# Altium project 004-H-01 SD data logger.PrjPcb
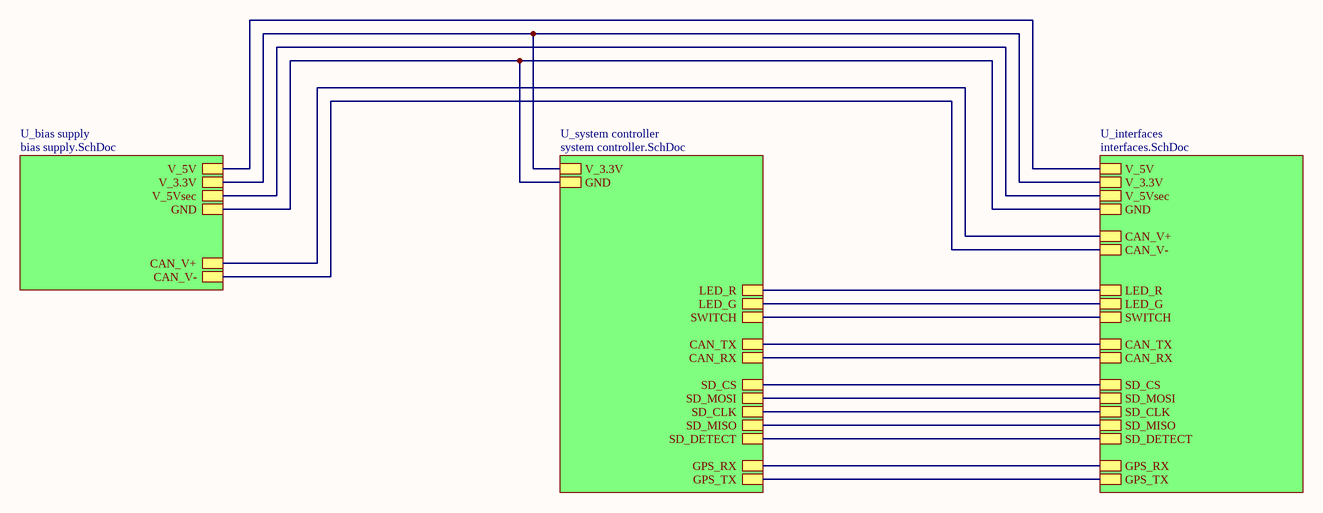
[diagram p0: 004-H-01 SD data logger cover.SchDoc]
4 sheets, 97 parts. Net scope: hierarchical (ports join the sheet entries above them; power ports are global).
Board file: 004-H-01 SD data logger.PcbDoc
Sheets:
  004-H-01 SD data logger cover.SchDoc
    U_bias supply = bias supply.SchDoc
    U_interfaces = interfaces.SchDoc
    U_system controller = system controller.SchDoc

## Sheet 004-H-01 SD data logger cover.SchDoc: 004-H-01 SD data logger
size A3; Organization: Sunflare Solar Team; Address1: Drachten; Address2: The Netherlands; Revision: V1.00; SheetNumber: 1; SheetTotal: 1

### Sub-sheets
U_bias supply = bias supply.SchDoc: V_5V, V_5Vsec, V_3.3V, GND, CAN_V-, CAN_V+
U_interfaces = interfaces.SchDoc: CAN_V-, CAN_V+, CAN_TX, CAN_RX, LED_R, LED_G, V_5V, V_3.3V, V_5Vsec, GND, SWITCH, SD_CS, SD_MOSI, SD_CLK, SD_MISO, SD_DETECT, GPS_RX, GPS_TX
U_system controller = system controller.SchDoc: V_3.3V, GND, CAN_TX, CAN_RX, LED_R, LED_G, SWITCH, SD_CS, SD_MOSI, SD_CLK, SD_MISO, SD_DETECT, GPS_RX, GPS_TX

### Nets
3.3V: sheet U_bias supply/V_3.3V, sheet U_interfaces/V_3.3V, sheet U_system controller/V_3.3V
5V: sheet U_bias supply/V_5V, sheet U_interfaces/V_5V
5Vsec: sheet U_bias supply/V_5Vsec, sheet U_interfaces/V_5Vsec
GND: sheet U_bias supply/GND, sheet U_interfaces/GND, sheet U_system controller/GND
CAN_+: sheet U_bias supply/CAN_V+, sheet U_interfaces/CAN_V+
CAN_-: sheet U_bias supply/CAN_V-, sheet U_interfaces/CAN_V-
CAN_RX: sheet U_interfaces/CAN_RX, sheet U_system controller/CAN_RX
CAN_TX: sheet U_interfaces/CAN_TX, sheet U_system controller/CAN_TX
LED_G: sheet U_interfaces/LED_R, sheet U_system controller/LED_R
LED_R: sheet U_interfaces/LED_G, sheet U_system controller/LED_G
NetR204_1: sheet U_interfaces/SD_CS, sheet U_system controller/SD_CS
NetR208_1: sheet U_interfaces/SWITCH, sheet U_system controller/SWITCH
NetR209_1: sheet U_interfaces/SD_MOSI, sheet U_system controller/SD_MOSI
NetR210_1: sheet U_interfaces/SD_CLK, sheet U_system controller/SD_CLK
NetR211_1: sheet U_interfaces/SD_MISO, sheet U_system controller/SD_MISO
NetR212_1: sheet U_interfaces/GPS_RX, sheet U_system controller/GPS_RX
NetR214_1: sheet U_interfaces/GPS_TX, sheet U_system controller/GPS_TX
NetR215_1: sheet U_interfaces/SD_DETECT, sheet U_system controller/SD_DETECT

### Notes on the sheet
- Title
- Size:
- Date:
- A3
- Version:
- Sheet
- of

## Sheet bias supply.SchDoc: 004-H-01 SD data logger
size A3; Organization: Sunflare Solar Team; Address1: Drachten; Address2: The Netherlands; Revision: V1.00; SheetNumber: 1; SheetTotal: 1
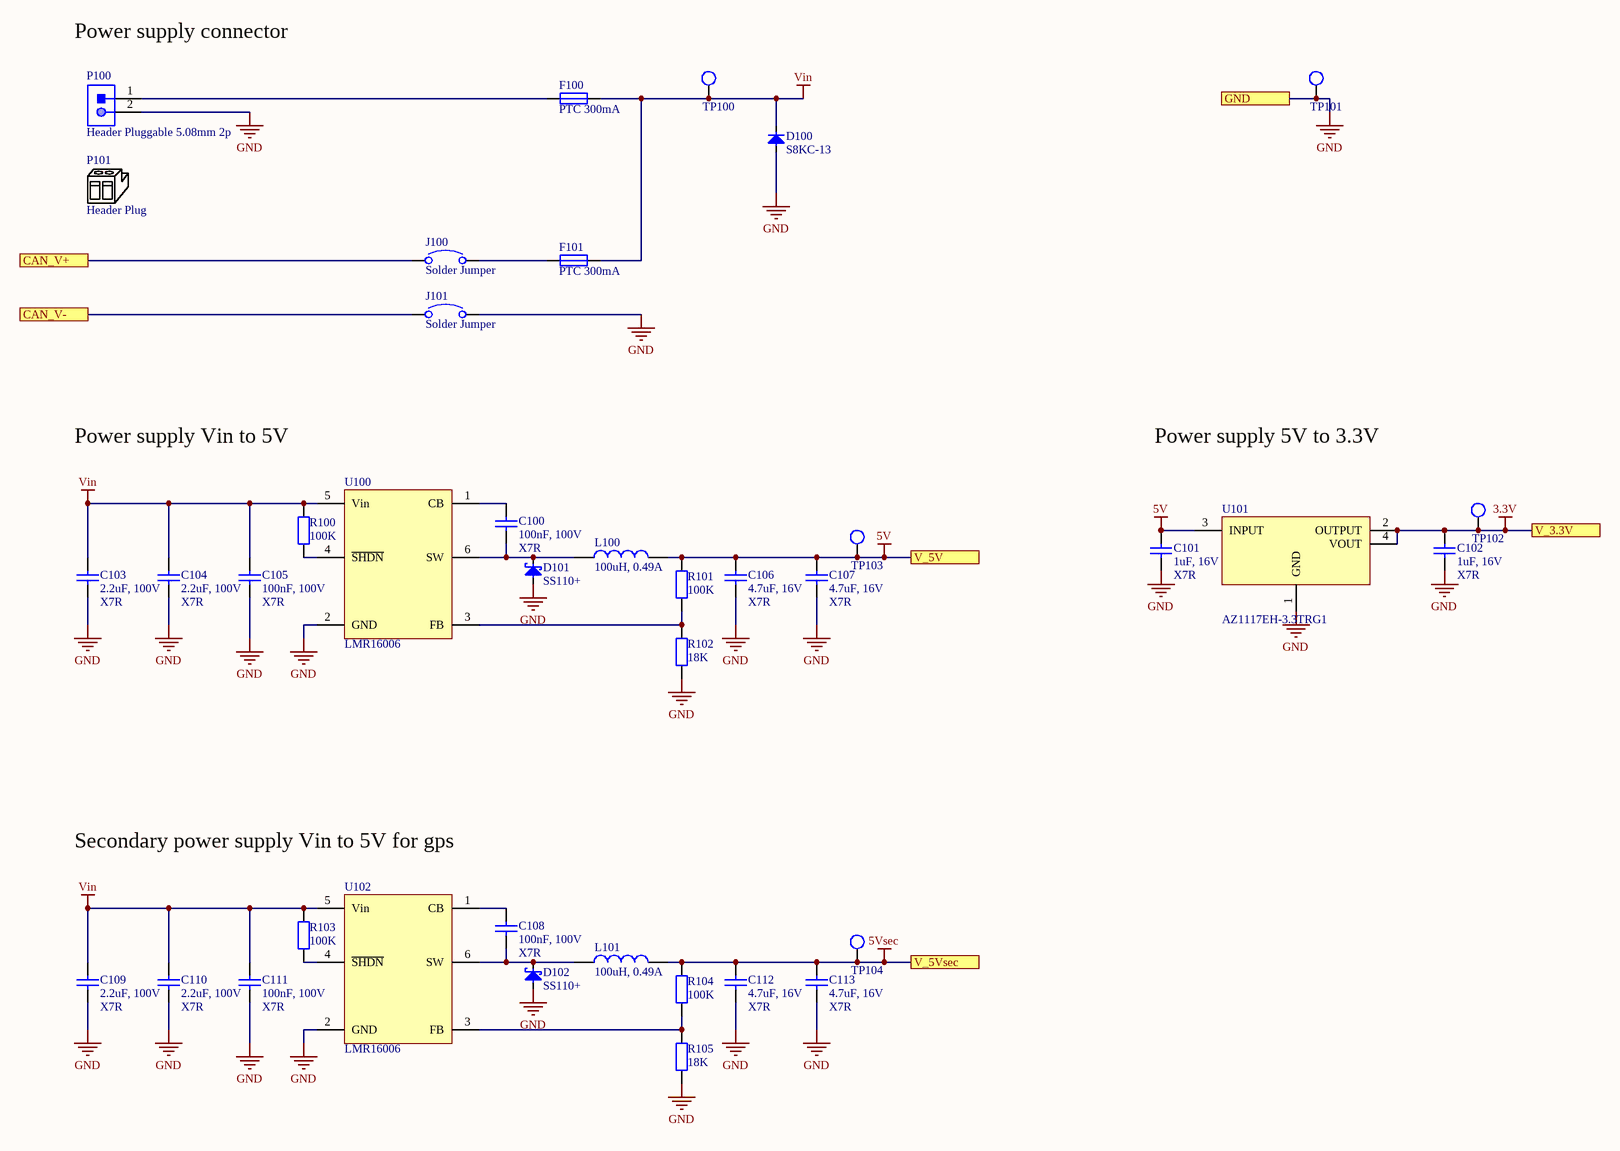
[diagram p1: bias supply.SchDoc]

### Parts
C100  100nF, 100V  Ceramic Type: X7R  [CAP_0805]
C101  1uF, 16V  Ceramic Type: X7R  [CAP_0805]
C102  1uF, 16V  Ceramic Type: X7R  [CAP_0805]
C103  2.2uF, 100V  Ceramic Type: X7R  [CAP_1210]
C104  2.2uF, 100V  Ceramic Type: X7R  [CAP_1210]
C105  100nF, 100V  Ceramic Type: X7R  [CAP_0805]
C106  4.7uF, 16V  Ceramic Type: X7R  [CAP_0805]
C107  4.7uF, 16V  Ceramic Type: X7R  [CAP_0805]
C108  100nF, 100V  Ceramic Type: X7R  [CAP_0805]
C109  2.2uF, 100V  Ceramic Type: X7R  [CAP_1210]
C110  2.2uF, 100V  Ceramic Type: X7R  [CAP_1210]
C111  100nF, 100V  Ceramic Type: X7R  [CAP_0805]
C112  4.7uF, 16V  Ceramic Type: X7R  [CAP_0805]
C113  4.7uF, 16V  Ceramic Type: X7R  [CAP_0805]
D100  S8KC-13  [DIODEDO-214AB]
D101  SS110+  [DIODEDO-214AC]
D102  SS110+  [DIODEDO-214AC]
F100  PTC 300mA  [PTC7451X12N]
F101  PTC 300mA  [PTC7451X12N]
J100  Solder Jumper  [SolderJumer]  (no BOM)
J101  Solder Jumper  [SolderJumer]  (no BOM)
L100  100uH, 0.49A  [WE-LQS_4025]
L101  100uH, 0.49A  [WE-LQS_4025]
P100  Header Pluggable 5.08mm 2p  [WE-691313510002]
P101  Header Plug  (mechanical)
R100  100K  [RES_0805]
R101  100K  [RES_0805]
R102  18K  [RES_0805]
R103  100K  [RES_0805]
R104  100K  [RES_0805]
R105  18K  [RES_0805]
TP100  Test Pad  [TestPad]  (value not drawn)  (no BOM)
TP101  Test Pad  [TestPad]  (value not drawn)  (no BOM)
TP102  Test Pad  [TestPad]  (value not drawn)  (no BOM)
TP103  Test Pad  [TestPad]  (value not drawn)  (no BOM)
TP104  Test Pad  [TestPad]  (value not drawn)  (no BOM)
U100  LMR16006  [SOT95P280X110-6N]
U101  AZ1117EH-3.3TRG1  [FP-SOT223-IPC_A]
U102  LMR16006  [SOT95P280X110-6N]

### Ports
CAN_V+, CAN_V-, GND, V_3.3V, V_5V, V_5Vsec

### Nets
3.3V: C102.1 TP102.1 U101.2(OUTPUT) U101.4(VOUT) ; port V_3.3V
5V: C101.2 C106.2 C107.1 L100.2 R101.2 TP103.1 U101.3(INPUT) ; port V_5V
5Vsec: C112.2 C113.1 L101.2 R104.2 TP104.1 ; port V_5Vsec
GND: C101.1 C102.2 C103.1 C104.2 C105.1 C106.1 C107.2 C109.1 C110.2 C111.1 C112.1 C113.2 D100.2(A) D101.2(A) D102.2(A) J101.2 P100.2 R102.1 R105.1 TP101.1 U100.2(GND) U101.1(GND) U102.2(GND) ; port GND
Vin: C103.2 C104.1 C105.2 C109.2 C110.1 C111.2 D100.1(K) F100.2 F101.2 R100.2 R103.2 TP100.1 U100.5(Vin) U102.5(Vin)
CAN_+: J100.1 ; port CAN_V+
CAN_-: J101.1 ; port CAN_V-
NetC100_1: C100.1 U100.1(CB)
NetC100_2: C100.2 D101.1(K) L100.1 U100.6(SW)
NetC108_1: C108.1 U102.1(CB)
NetC108_2: C108.2 D102.1(K) L101.1 U102.6(SW)
NetF100_1: F100.1 P100.1
NetF101_1: F101.1 J100.2
NetR100_1: R100.1 U100.4(~{SHDN})
NetR101_1: R101.1 R102.2 U100.3(FB)
NetR103_1: R103.1 U102.4(~{SHDN})
NetR104_1: R104.1 R105.2 U102.3(FB)

### Notes on the sheet
- Power supply connector
- Power supply Vin to 5V
- Power supply 5V to 3.3V
- Secondary power supply Vin to 5V for gps
- Title
- Size:
- Date:
- A3
- Version:
- Sheet
- of

### Library data of the parts
C100 C105 C108 C111 = CAP_0805_100nF_100V: WCAP-CSGP Multilayer Ceramic Chip Capacitor, General Purpose, size 0805, X7R, 100nF, 100V; Manufacturer Part Number: 885012207128; Manufacturer: Wurth Elektronik; Rated Voltage: 100VDC; Isolation Resistance: >=1GOhm; Capacitance Tolerance: +/-10%; Technical Reference: X7R0805104K100DFCT10000; ComponentLink1Description: Manufacturer; ComponentLink1URL: http://www.we-online.de; ComponentLink2Description: Datasheet; ComponentLink2URL: https://www.we-online.com/catalog/datasheet/885012207128.pdf; Operating Temperature: -55 to +125degC; Packaging: Tape and Reel; Published Date: May 2020; Dissipation Factor: =<2.5%; Height: 1.25mm; Mounting Technology: SMT; Size: 0805; Capacitance: 100nF; Supplier 1: Farnell; Supplier Part Number 1: 2812440
C101 C102 = CAP_0805_1uF_16V: WCAP-CSGP Multilayer Ceramic Chip Capacitor, General Purpose, size 0805, X7R, 1uF, 16V; Manufacturer Part Number: 885012207051; Manufacturer: Wurth Elektronik; Rated Voltage: 16VDC; Isolation Resistance: >=0.5GOhm; Capacitance Tolerance: +/-10%; Technical Reference: X7R0805105K016DFCT10000; ComponentLink1Description: Manufacturer; ComponentLink1URL: http://www.we-online.de; ComponentLink2Description: Datasheet; ComponentLink2URL: https://www.we-online.com/catalog/datasheet/885012207051.pdf; Operating Temperature: -55 to +125degC; Packaging: Tape and Reel; Published Date: May 2020; Dissipation Factor: =<5%; Height: 1.25mm; Mounting Technology: SMT; Size: 0805; Capacitance: 1uF; Supplier 1: Farnell; Supplier Part Number 1: 2534058
C103 C104 C109 C110 = CAP_1210_2.2uF_100V: WCAP-CSGP Multilayer Ceramic Chip Capacitor, General Purpose, size 1210, X7R, 2.2uF, 100V; Manufacturer Part Number: 885012209071; Manufacturer: Wurth Elektronik; Rated Voltage: 100VDC; Isolation Resistance: >=0.05GOhm; Capacitance Tolerance: +/-10%; Technical Reference: X7R1210225K100DFCT10000; ComponentLink1Description: Manufacturer; ComponentLink1URL: http://www.we-online.de; ComponentLink2Description: Datasheet; ComponentLink2URL: https://www.we-online.com/catalog/datasheet/885012209071.pdf; Operating Temperature: -55 to +125degC; Packaging: Tape and Reel; Published Date: May 2020; Dissipation Factor: =<5%; Height: 2.5mm; Mounting Technology: SMT; Size: 1210; Capacitance: 2.2uF
C106 C107 C112 C113 = CAP_0805_4.7uF_16V: WCAP-CSGP Multilayer Ceramic Chip Capacitor, General Purpose, size 0805, X7R, 4.7uF, 16V; Manufacturer Part Number: 885012207053; Manufacturer: Wurth Elektronik; Rated Voltage: 16VDC; Isolation Resistance: >=0.02GOhm; Capacitance Tolerance: +/-10%; Technical Reference: X7R0805475K016DFCT10000; ComponentLink1Description: Manufacturer; ComponentLink1URL: http://www.we-online.de; ComponentLink2Description: Datasheet; ComponentLink2URL: https://www.we-online.com/catalog/datasheet/885012207053.pdf; Operating Temperature: -55 to +125degC; Packaging: Tape and Reel; Published Date: May 2020; Dissipation Factor: =<10%; Height: 1.25mm; Mounting Technology: SMT; Size: 0805; Capacitance: 4.7uF; Supplier 1: Farnell; Supplier Part Number 1: 2495191
D100 = Diode S8KC-13: Diode; Manufacturer: Diodes inc; Manufacturer Part No: S8KC-13; Supplier 1: Farnell; Supplier Part Number 1: 3127431; Supplier 2: Farnell; Supplier Part Number 2: 2675073
D101 D102 = Diode Schottky SS110+: Diode Schottky; Manufacturer: Multicomp; Manufacturer Part No: SS110+; Supplier 1: Farnell; Supplier Part Number 1: 4085140
F100 F101 = PTC 300mA: Fuse; Manufacturer: Multicomp Pro; Manufacturer Part No: MC33189; Supplier 1: Farnell; Supplier Part Number 1: 1800748
J100 J101 = SolderJumper: Solder jumper open; Manufacturer: -; Manufacturer Part No: -
L100 L101 = Inductor 100uH 0.49A 1043mOhm: WE-LQS SMT Power Inductor, size 4025, 100uH, 0.49A; Manufacturer: Wurth Elektronik; Manufacturer Part Number: 74404043101A; Saturation Current: 0.29A; Self Resonant Frequency: 11MHz; ComponentLink1Description: Manufacturer; ComponentLink1URL: http://www.we-online.de; ComponentLink2Description: Datasheet; ComponentLink2URL: https://www.we-online.com/catalog/datasheet/74404043101A.pdf; Published Date: May 2020; Rated Current: 0.49A; DC Resistance: 1043mOhm; Operating Temperature: -40 to +125degC; Mounting Technology: SMT; Packaging: Tape and Reel; Inductance: 100uH; Size: 4025; Supplier 1: Farnell; Supplier Part Number 1: 2749073
P100 = Header Pluggable 5.08mm 2p: WR-TBL Serie 313 Close Horizontal PCB Header, Pluggable, pitch 5.08mm, 2p; Part Number: 691313510002; Compliance: RoHS; Modularity: No; Pin Number: 2; Rated Current [UL]: 20A; Working Voltage [UL]: 300VAC; ComponentLink1Description: Manufacturer; ComponentLink1URL: http://www.we-online.de; ComponentLink2URL: https://katalog.we-online.de/em/datasheet/691313510002.pdf; ComponentLink2Description: Datasheet; Mounting Technology: THT; Packaging: Box; Operating Temperature: -40 to +105degC; PCB/Cable/Panel: PCB; Pitch: 5.08mm; Published Date: October 2019; Type: Horizontal; Publisher: Wurth Elektronik; Application: Pluggable; Supplier 1: Farnell; Supplier Part Number 1: 1641993
P101 = Plug Pluggable 5.08mm 2p: WR-TBL Series 351 - 5.08 mm Vertical, pitch 5.08mm, 2p; Part Number: 691351500002; Compliance: RoHS; Modularity: No; PCB/Cable/Panel: Cable; Pin Number: 2; Rated Current [UL]: 20A; Working Voltage [UL]: 300VAC; ComponentLink1Description: Manufacturer; ComponentLink1URL: http://www.we-online.de; ComponentLink2URL: https://katalog.we-online.de/em/datasheet/691313510002.pdf; ComponentLink2Description: Datasheet; Packaging: Box; Operating Temperature: -40 to +105degC; Pitch: 5.08mm; Published Date: October 2019; Type: Plug; Publisher: Wurth Elektronik; Application: Pluggable; Supplier 1: Farnell; Supplier Part Number 1: 1641952
R100 R101 R103 R104 = RES_0805_100K: Thick Film Resistor, size 0805, 1%; Rated Power: 0.125W; Resistance Tolerance: +/-1%; Resistance: 100K; Height: 0.6mm; Operating Temperature: -55 to +155degC; Mounting Technology: SMT; Packaging: Tape and Reel; Size: 0805; Length: 2mm; Width: 1.25mm
R102 R105 = RES_0805_18K: Thick Film Resistor, size 0805, 1%; Rated Power: 0.125W; Resistance Tolerance: +/-1%; Resistance: 18K; Height: 0.6mm; Operating Temperature: -55 to +155degC; Mounting Technology: SMT; Packaging: Tape and Reel; Size: 0805; Length: 2mm; Width: 1.25mm
TP100-TP104 = Test Pad: Test pad 2mm; Manufacturer: -; Manufacturer Part No: -
U100 U102 = LMR16006: DC-DC Switching Buck (Step Down) Regulator, Adjustable, 4V-60Vin, 800mV-55Vout, 600mAout, TSOT-23-6; Manufacturer: Texas Instruments; Manufacturer Part No: LMR16006XDDCT; Supplier 1: Farnell; Supplier Part Number 1: 3121632
U101 = AZ1117EH-3.3TRG1: IC REG LINEAR 3.3V 1A SOT223; Manufacturer: Diodes Inc; Operating Supply Current: 3.5mA; Polarity: Positive; Reference Voltage: 1.262V; Max Input Voltage: 13V; Accuracy: 1%; Power Supply Rejection Ratio (PSRR): 70dB; Number of Regulators: 1; Dropout Voltage: 1.1V; Output Type: Fixed; Output Voltage: 3.3V; Package Quantity: 4000; Lead Free: Lead Free; Number of Pins: 3; Output Current: 1A; Packaging: Tape and Reel; Min Operating Temperature: -40°C; Max Operating Temperature: 125°C; Quiescent Current: 3.5mA; Contact Plating: Tin; Case/Package: TO-261-4; Weight: 0.000282oz; Mount: Surface Mount; Number of Outputs: 1; Max Output Current: 1A; Manufacturer Part Number: AZ1117EH-3.3TRG1; Supplier 1: Farnell; Supplier Part Number 1: 3483084

## Sheet interfaces.SchDoc: 004-H-01 SD data logger
size A3; Organization: Sunflare Solar Team; Address1: Drachten; Address2: The Netherlands; Revision: V1.00; SheetNumber: 1; SheetTotal: 1
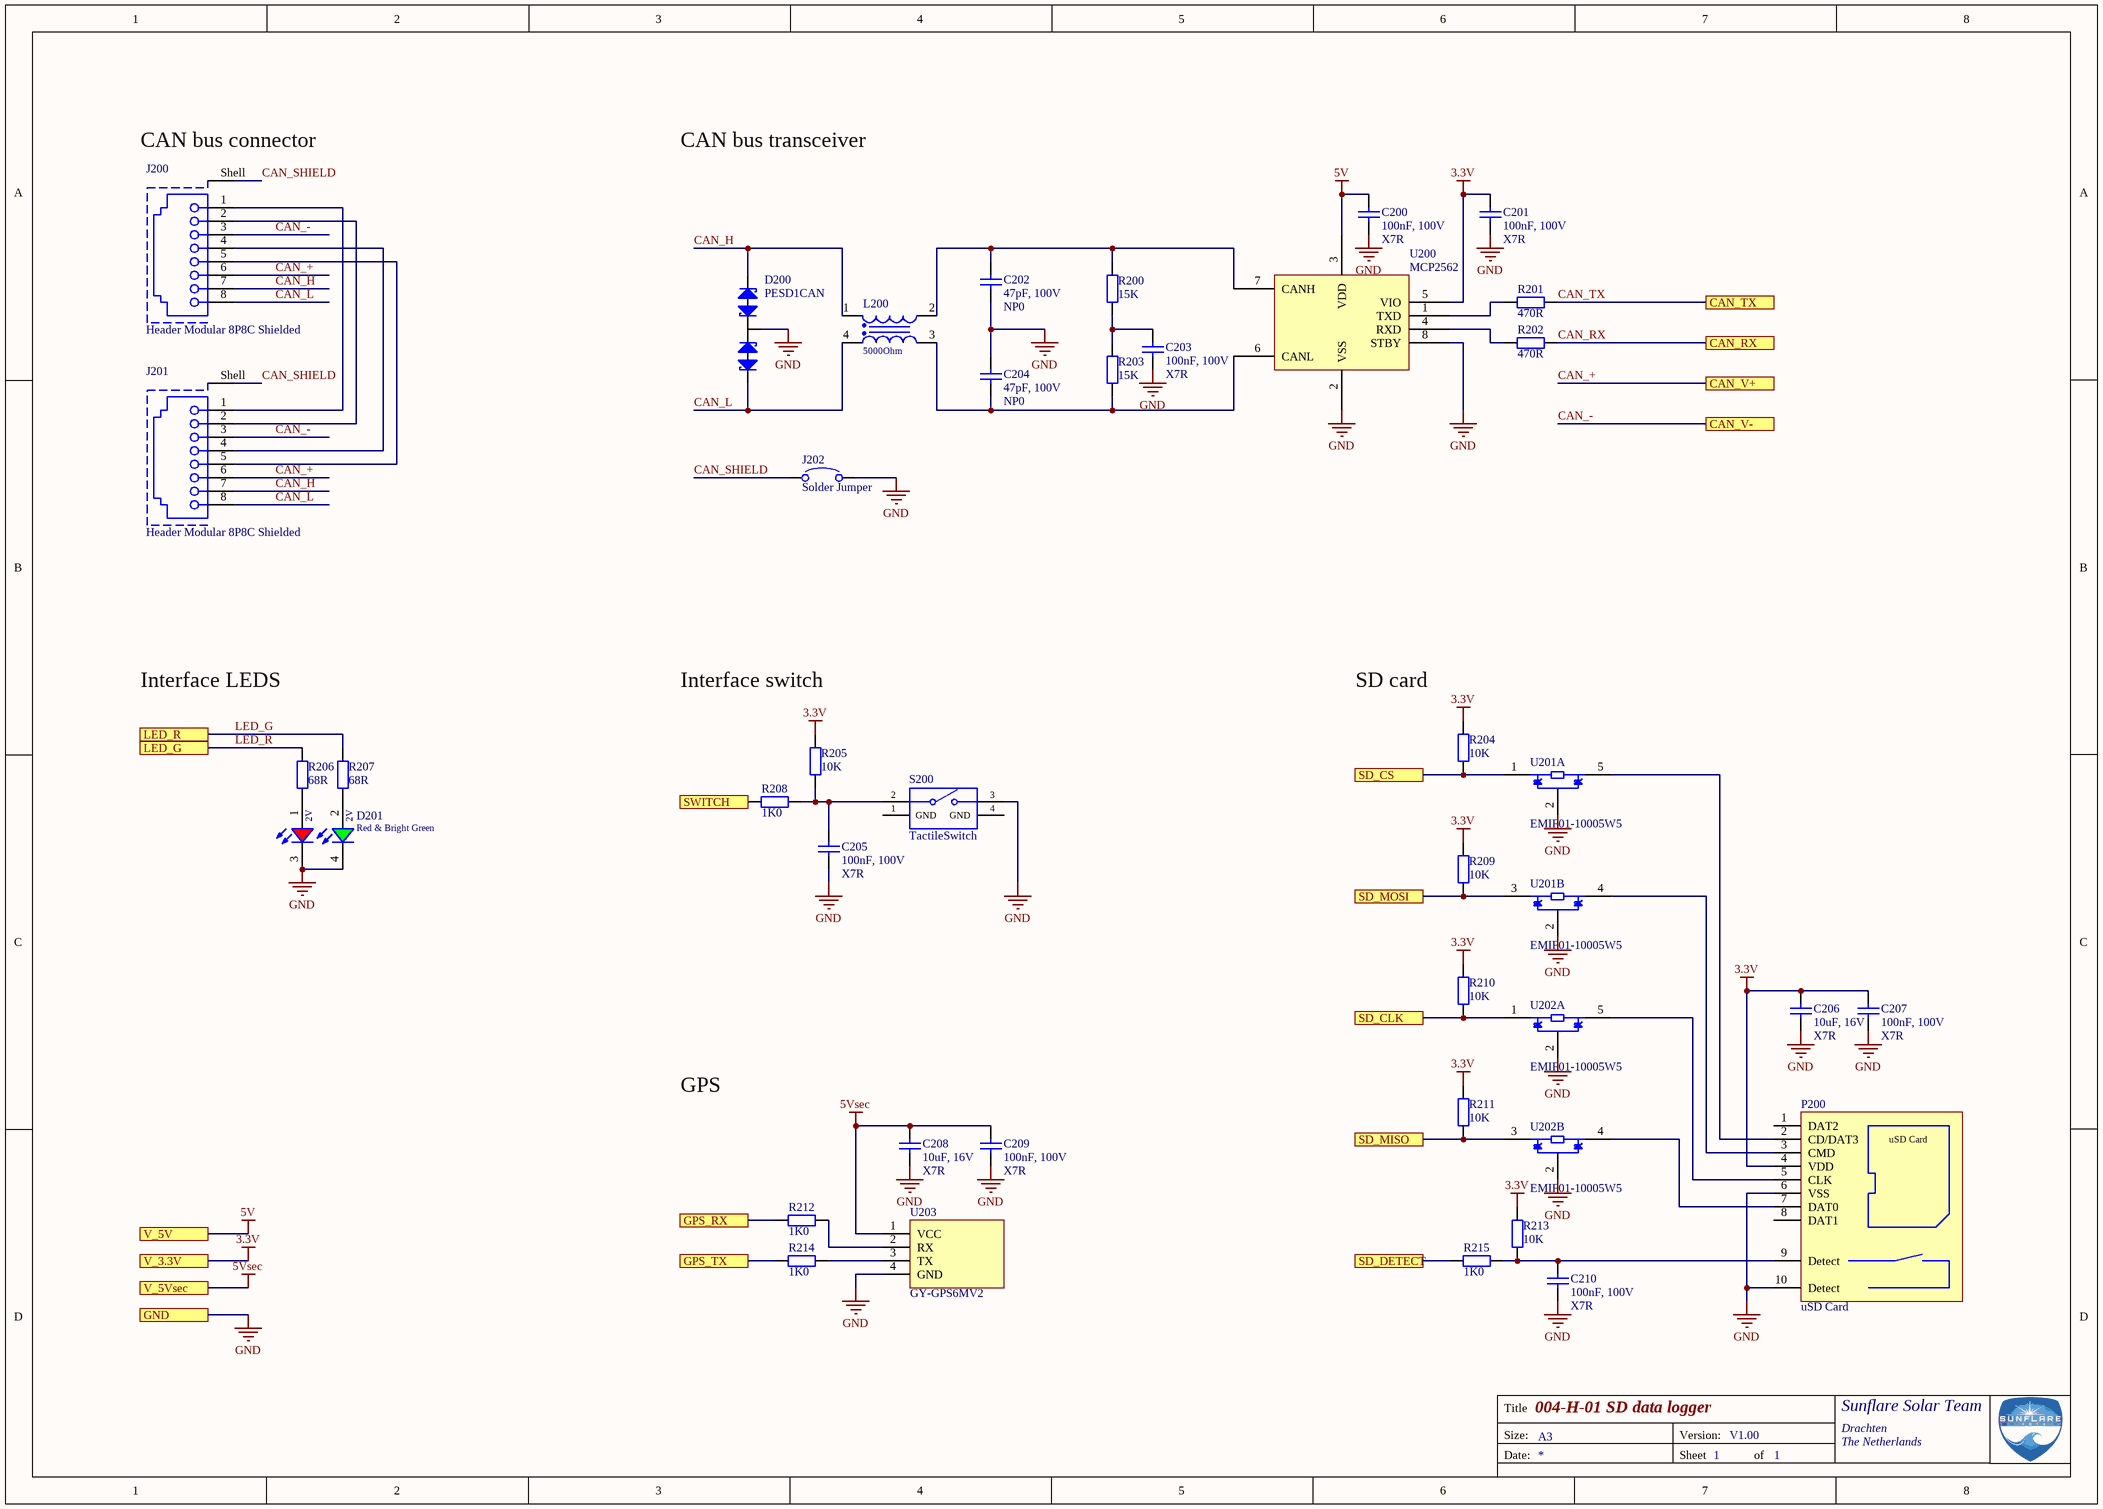
[diagram p2: interfaces.SchDoc]

### Parts
C200  100nF, 100V  Ceramic Type: X7R  [CAP_0805]
C201  100nF, 100V  Ceramic Type: X7R  [CAP_0805]
C202  47pF, 100V  Ceramic Type: NP0  [CAP_0805]
C203  100nF, 100V  Ceramic Type: X7R  [CAP_0805]
C204  47pF, 100V  Ceramic Type: NP0  [CAP_0805]
C205  100nF, 100V  Ceramic Type: X7R  [CAP_0805]
C206  10uF, 16V  Ceramic Type: X7R  [CAP_1210]
C207  100nF, 100V  Ceramic Type: X7R  [CAP_0805]
C208  10uF, 16V  Ceramic Type: X7R  [CAP_1210]
C209  100nF, 100V  Ceramic Type: X7R  [CAP_0805]
C210  100nF, 100V  Ceramic Type: X7R  [CAP_0805]
D200  PESD1CAN  [SOT23-3N]
D201  Red & Bright Green  [WL-SBTW_3528]
J200  Header Modular 8P8C Shielded  [WE-615008140621]
J201  Header Modular 8P8C Shielded  [WE-615008140621]
J202  Solder Jumper  [SolderJumer]  (no BOM)
L200  5000Ohm  [WE-CNSW_1812]
P200  uSD Card  [DM3AT-SF-PEJM5]
R200  15K  [RES_0805]
R201  470R  [RES_0805]
R202  470R  [RES_0805]
R203  15K  [RES_0805]
R204  10K  [RES_0805]
R205  10K  [RES_0805]
R206  68R  [RES_0805]
R207  68R  [RES_0805]
R208  1K0  [RES_0805]
R209  10K  [RES_0805]
R210  10K  [RES_0805]
R211  10K  [RES_0805]
R212  1K0  [RES_0805]
R213  10K  [RES_0805]
R214  1K0  [RES_0805]
R215  1K0  [RES_0805]
S200  TactileSwitch  [4312560387x6]
U200  MCP2562  [SOIC-8N]
U201  EMIF01-10005W5  [SOT95P280X110-6N]  (parts A,B of 2)
U202  EMIF01-10005W5  [SOT95P280X110-6N]  (parts A,B of 2)
U203  GY-GPS6MV2  [GY-GPS6MV2]

### Ports
CAN_RX, CAN_TX, CAN_V+, CAN_V-, GND, GPS_RX, GPS_TX, LED_G, LED_R, SD_CLK, SD_CS, SD_DETECT, SD_MISO, SD_MOSI, SWITCH, V_3.3V, V_5V, V_5Vsec

### Nets
3.3V: C201.2 C206.2 C207.2 P200.4(VDD) R204.2 R205.2 R209.2 R210.2 R211.2 R213.2 U200.5(VIO) ; port V_3.3V
5V: C200.2 U200.3(VDD) ; port V_5V
5Vsec: C208.2 C209.2 U203.1(VCC) ; port V_5Vsec
GND: C200.1 C201.1 C202.1 C203.1 C204.2 C205.1 C206.1 C207.1 C208.1 C209.1 C210.1 D200.3 D201.3(K) D201.4(K) J202.2 P200.6(VSS) P200.10(Detect) S200.3 U200.2(VSS) U200.8(STBY) U201.2 U202.2 U203.4(GND) ; port GND
CAN_+: J200.6 J201.6 ; port CAN_V+
CAN_-: J200.3 J201.3 ; port CAN_V-
CAN_H: D200.2 J200.7 J201.7 L200.1
CAN_L: D200.1 J200.8 J201.8 L200.4
CAN_RX: R202.2 ; port CAN_RX
CAN_SHIELD: J200.Shell J201.Shell J202.1
CAN_TX: R201.2 ; port CAN_TX
LED_G: R207.2 ; port LED_R
LED_R: R206.1 ; port LED_G
NetC202_2: C202.2 L200.2 R200.2 U200.7(CANH)
NetC203_2: C203.2 R200.1 R203.2
NetC204_1: C204.1 L200.3 R203.1 U200.6(CANL)
NetC205_2: C205.2 R205.1 R208.2 S200.2
NetC210_2: C210.2 P200.9(Detect) R213.1 R215.2
NetD201_1: D201.1(A) R206.2
NetD201_2: D201.2(A) R207.1
NetJ200_1: J200.1 J201.1
NetJ200_2: J200.2 J201.2
NetJ200_4: J200.4 J201.4
NetJ200_5: J200.5 J201.5
NetP200_2: P200.2(CD/DAT3) U201.5
NetP200_3: P200.3(CMD) U201.4
NetP200_5: P200.5(CLK) U202.5
NetP200_7: P200.7(DAT0) U202.4
NetR201_1: R201.1 U200.1(TXD)
NetR202_1: R202.1 U200.4(RXD)
NetR204_1: R204.1 U201.1 ; port SD_CS
NetR208_1: R208.1 ; port SWITCH
NetR209_1: R209.1 U201.3 ; port SD_MOSI
NetR210_1: R210.1 U202.1 ; port SD_CLK
NetR211_1: R211.1 U202.3 ; port SD_MISO
NetR212_1: R212.1 ; port GPS_RX
NetR212_2: R212.2 U203.2(RX)
NetR214_1: R214.1 ; port GPS_TX
NetR214_2: R214.2 U203.3(TX)
NetR215_1: R215.1 ; port SD_DETECT

Not connected (* = marked no-connect by the designer): P200 1(DAT2) 8(DAT1); S200 1(GND) 4(GND)

### Notes on the sheet
- (near J200) CAN bus connector
- CAN bus transceiver
- Interface LEDS
- Interface switch
- (near R204) SD card
- GPS
- Title
- Size:
- Date:
- A3
- Version:
- Sheet
- of

### Library data of the parts
C200 C201 C203 C205 C207 C209 C210 = CAP_0805_100nF_100V: as C100 on sheet bias supply; ComponentLink1Description: Manufacturer; ComponentLink1URL: http://www.we-online.de; ComponentLink2Description: Datasheet; ComponentLink2URL: https://www.we-online.com/catalog/datasheet/885012207128.pdf; Operating Temperature: -55 to +125degC; Packaging: Tape and Reel; Published Date: May 2020; Dissipation Factor: =<2.5%; Height: 1.25mm; Mounting Technology: SMT; Size: 0805; Capacitance: 100nF; Supplier 1: Farnell; Supplier Part Number 1: 2812440
C202 C204 = CAP_0805_47pF_100V: WCAP-CSGP Multilayer Ceramic Chip Capacitor, General Purpose, size 0805, NP0, 47pF, 100V; Manufacturer Part Number: 885012007080; Manufacturer: Wurth Elektronik; Rated Voltage: 100VDC; Isolation Resistance: >=10GOhm; Capacitance Tolerance: +/-5%; Dissipation Factor: Q>=1000; Technical Reference: NP00805470J100DFCT10000; ComponentLink1Description: Manufacturer; ComponentLink1URL: http://www.we-online.de; ComponentLink2Description: Datasheet; ComponentLink2URL: https://www.we-online.com/catalog/datasheet/885012007080.pdf; Operating Temperature: -55 to +125degC; Packaging: Tape and Reel; Published Date: May 2020; Height: 0.6mm; Mounting Technology: SMT; Size: 0805; Capacitance: 47pF; Supplier 1: Farnell; Supplier Part Number 1: 2812160
C206 C208 = CAP_1210_10uF_16V: WCAP-CSGP Multilayer Ceramic Chip Capacitor, General Purpose, size 1210, X7R, 10uF, 16V; Manufacturer Part Number: 885012209014; Manufacturer: Wurth Elektronik; Rated Voltage: 16VDC; Isolation Resistance: >=0.1GOhm; Capacitance Tolerance: +/-10%; Technical Reference: X7R1210106K016DFCT10000; ComponentLink1Description: Manufacturer; ComponentLink1URL: http://www.we-online.de; ComponentLink2Description: Datasheet; ComponentLink2URL: https://www.we-online.com/catalog/datasheet/885012209014.pdf; Operating Temperature: -55 to +125degC; Packaging: Tape and Reel; Published Date: May 2020; Dissipation Factor: =<5%; Height: 2mm; Mounting Technology: SMT; Size: 1210; Capacitance: 10uF
D200 = PESD1CAN: ESD Protection Device, TVS, 70 V, SOT-23, 3 Pins; Manufacturer: NXP; Manufacturer Part No: PESD1CAN; Supplier 1: Farnell; Supplier Part Number 1: 1510703
D201 = LED bicolor, Red and Green: WL-SBTW SMD Bi-color TOP LED Waterclear, Red & Bright Green, 120degC; Part Number: 150141RV73100; Viewing Angle: 120deg; Peak Wavelength: 630nm@Red, 572nm@Bright Green; Dominant Wavelength: 625nm@Red, 570nm@Bright Green; Luminous Intensity: 250mcd@Red, 60mcd@Bright Green; Chip Technology: AlInGaP; Forward Voltage: 2V; ComponentLink1Description: Manufacturer; ComponentLink1URL: http://www.we-online.de; ComponentLink2Description: Datasheet; ComponentLink2URL: https://katalog.we-online.de/led/datasheet/150141RV73100.pdf; Published Date: June 2019; Publisher: Wurth Elektronik; Size: 3528; Operating Temperature: -40 to +85degC; Emitting Color: Red & Bright Green; Mounting Technology: SMT; Packaging: Tape and Reel; Supplier 1: Farnell; Supplier Part Number 1: 2322113
J200 J201 = Header Modular 8P8C Shielded: WR-MJ Modular Jack THT Horizontal Shielded with EMI Panel Finger 8P8C Tab Up; Manufacturer: Wurth Elektronik; Manufacturer Part Number: 615008140621; Rated Current: 1.5A; Contact Resistance: 20mOhm; Insulation Resistance: 500MOhm; Working Voltage: 120VAC; Withstanding Voltage: 1000VAC; ComponentLink1Description: Manufacturer; ComponentLink1URL: http://www.we-online.de; ComponentLink2Description: Datasheet; ComponentLink2URL: https://katalog.we-online.com/em/datasheet/615008140621.pdf; Packaging: Tray; Mounting Technology: THT; Operating Temperature: -40 to +85degC; Published Date: September 2020; xPxC: 8P8C; Type: Horizontal; Supplier 1: Farnell; Supplier Part Number 1: 1841173
J202 = SolderJumper: Solder jumper open; Manufacturer: -; Manufacturer Part No: -
L200 = CommonModeChoke: WE-CNSW SMT Common Mode Line Filter, size 1812, 5000Ohm, 0.45A, 60V; Manufacturer Part Number: 744235110; Manufacturer: Wurth Elektronik; DC Resistance max.: 0.8Ohm; Impedance Test Condition: 100MHz; Insulation Test Voltage: 125VAC; Winding Style: bifiliar; ComponentLink1Description: Manufacturer; ComponentLink1URL: http://www.we-online.de; ComponentLink2Description: Datasheet; ComponentLink2URL: https://www.we-online.com/catalog/datasheet/744235110.pdf; Operating Temperature: -40 to +125degC; Packaging: Tape and Reel; Published Date: April 2020; Rated Current: 0.45A; Size: 1812; Impedance: 5000Ohm; Rated Voltage: 60V; Mounting Technology: SMT; Supplier 1: Farnell; Supplier Part Number 1: 2249869
P200 = uSD slot: SD slot connector with card detect; Manufacturer: Hirose; Manufacturer Part No: DM3AT-SF-PEJM5; Supplier 1: Farnell; Supplier Part Number 1: 2427719
R200 R203 = RES_0805_15K: Thick Film Resistor, size 0805, 1%; Rated Power: 0.125W; Resistance Tolerance: +/-1%; Resistance: 15K; Height: 0.6mm; Operating Temperature: -55 to +155degC; Mounting Technology: SMT; Packaging: Tape and Reel; Size: 0805; Length: 2mm; Width: 1.25mm
R201 R202 = RES_0805_470R: Thick Film Resistor, size 0805, 1%; Rated Power: 0.125W; Resistance Tolerance: +/-1%; Resistance: 470R; Height: 0.6mm; Operating Temperature: -55 to +155degC; Mounting Technology: SMT; Packaging: Tape and Reel; Size: 0805; Length: 2mm; Width: 1.25mm
R204 R205 R209-R211 R213 = RES_0805_10K: Thick Film Resistor, size 0805, 1%; Rated Power: 0.125W; Resistance Tolerance: +/-1%; Resistance: 10K; Height: 0.6mm; Operating Temperature: -55 to +155degC; Mounting Technology: SMT; Packaging: Tape and Reel; Size: 0805; Length: 2mm; Width: 1.25mm
R206 R207 = RES_0805_68R: Thick Film Resistor, size 0805, 1%; Rated Power: 0.125W; Resistance Tolerance: +/-1%; Resistance: 68R; Height: 0.6mm; Operating Temperature: -55 to +155degC; Mounting Technology: SMT; Packaging: Tape and Reel; Size: 0805; Length: 2mm; Width: 1.25mm
R208 R212 R214 R215 = RES_0805_1K0: Thick Film Resistor, size 0805, 1%; Rated Power: 0.125W; Resistance Tolerance: +/-1%; Resistance: 1K0; Height: 0.6mm; Operating Temperature: -55 to +155degC; Mounting Technology: SMT; Packaging: Tape and Reel; Size: 0805; Length: 2mm; Width: 1.25mm
S200 = TactileSwitch: WS-TATU THT Tact Switch 6x6mm Right Angled Type with ground terminal, height 3.85mm, 160gf; Part Number: 431256038716; Rated Voltage: 12VDC; Rated Current: 50mA; Washable: No; ComponentLink1Description: Manufacturer; ComponentLink1URL: http://www.we-online.de; ComponentLink2Description: Datasheet; ComponentLink2URL: https://katalog.we-online.com/em/datasheet/431256038716.pdf; Operating Temperature: -40 to +85degC; Published Date: September 2019; Contact Material: Stainless Steel; Height: 3.85mm; Mounting Technology: THT; Contact Plating: Silver; Operation Force: 160gf; Packaging: Bulk; Terminal Material: Copper Alloy; Publisher: Wurth Elektronik; Terminal Plating: Silver
U200 = MCP2562: CAN Bus, Transceiver, CAN, LIN, 1, 1, 4.5 V, 5.5 V, SOIC; Manufacturer: Microchip; Manufacturer Part No: MCP2562-E/SN; Supplier 1: Farnell; Supplier Part Number 1: 2362839
U201 U202 = EMIF01-10005W5: 2 Line EMI Filter with ESDProtection; Manufacturer: ST Microelectronics; Manufacturer Part No: EMIF01-10005W5; Supplier 1: Farnell; Supplier Part Number 1: 2629722
U203 = GY-GPS6MV2: GPS module; Manufacturer: NEO; Manufacturer Part No: GY-GPS6MV2

## Sheet system controller.SchDoc: 004-H-01 SD data logger
size A3; Organization: Sunflare Solar Team; Address1: Drachten; Address2: The Netherlands; Revision: V1.00; SheetNumber: 1; SheetTotal: 1
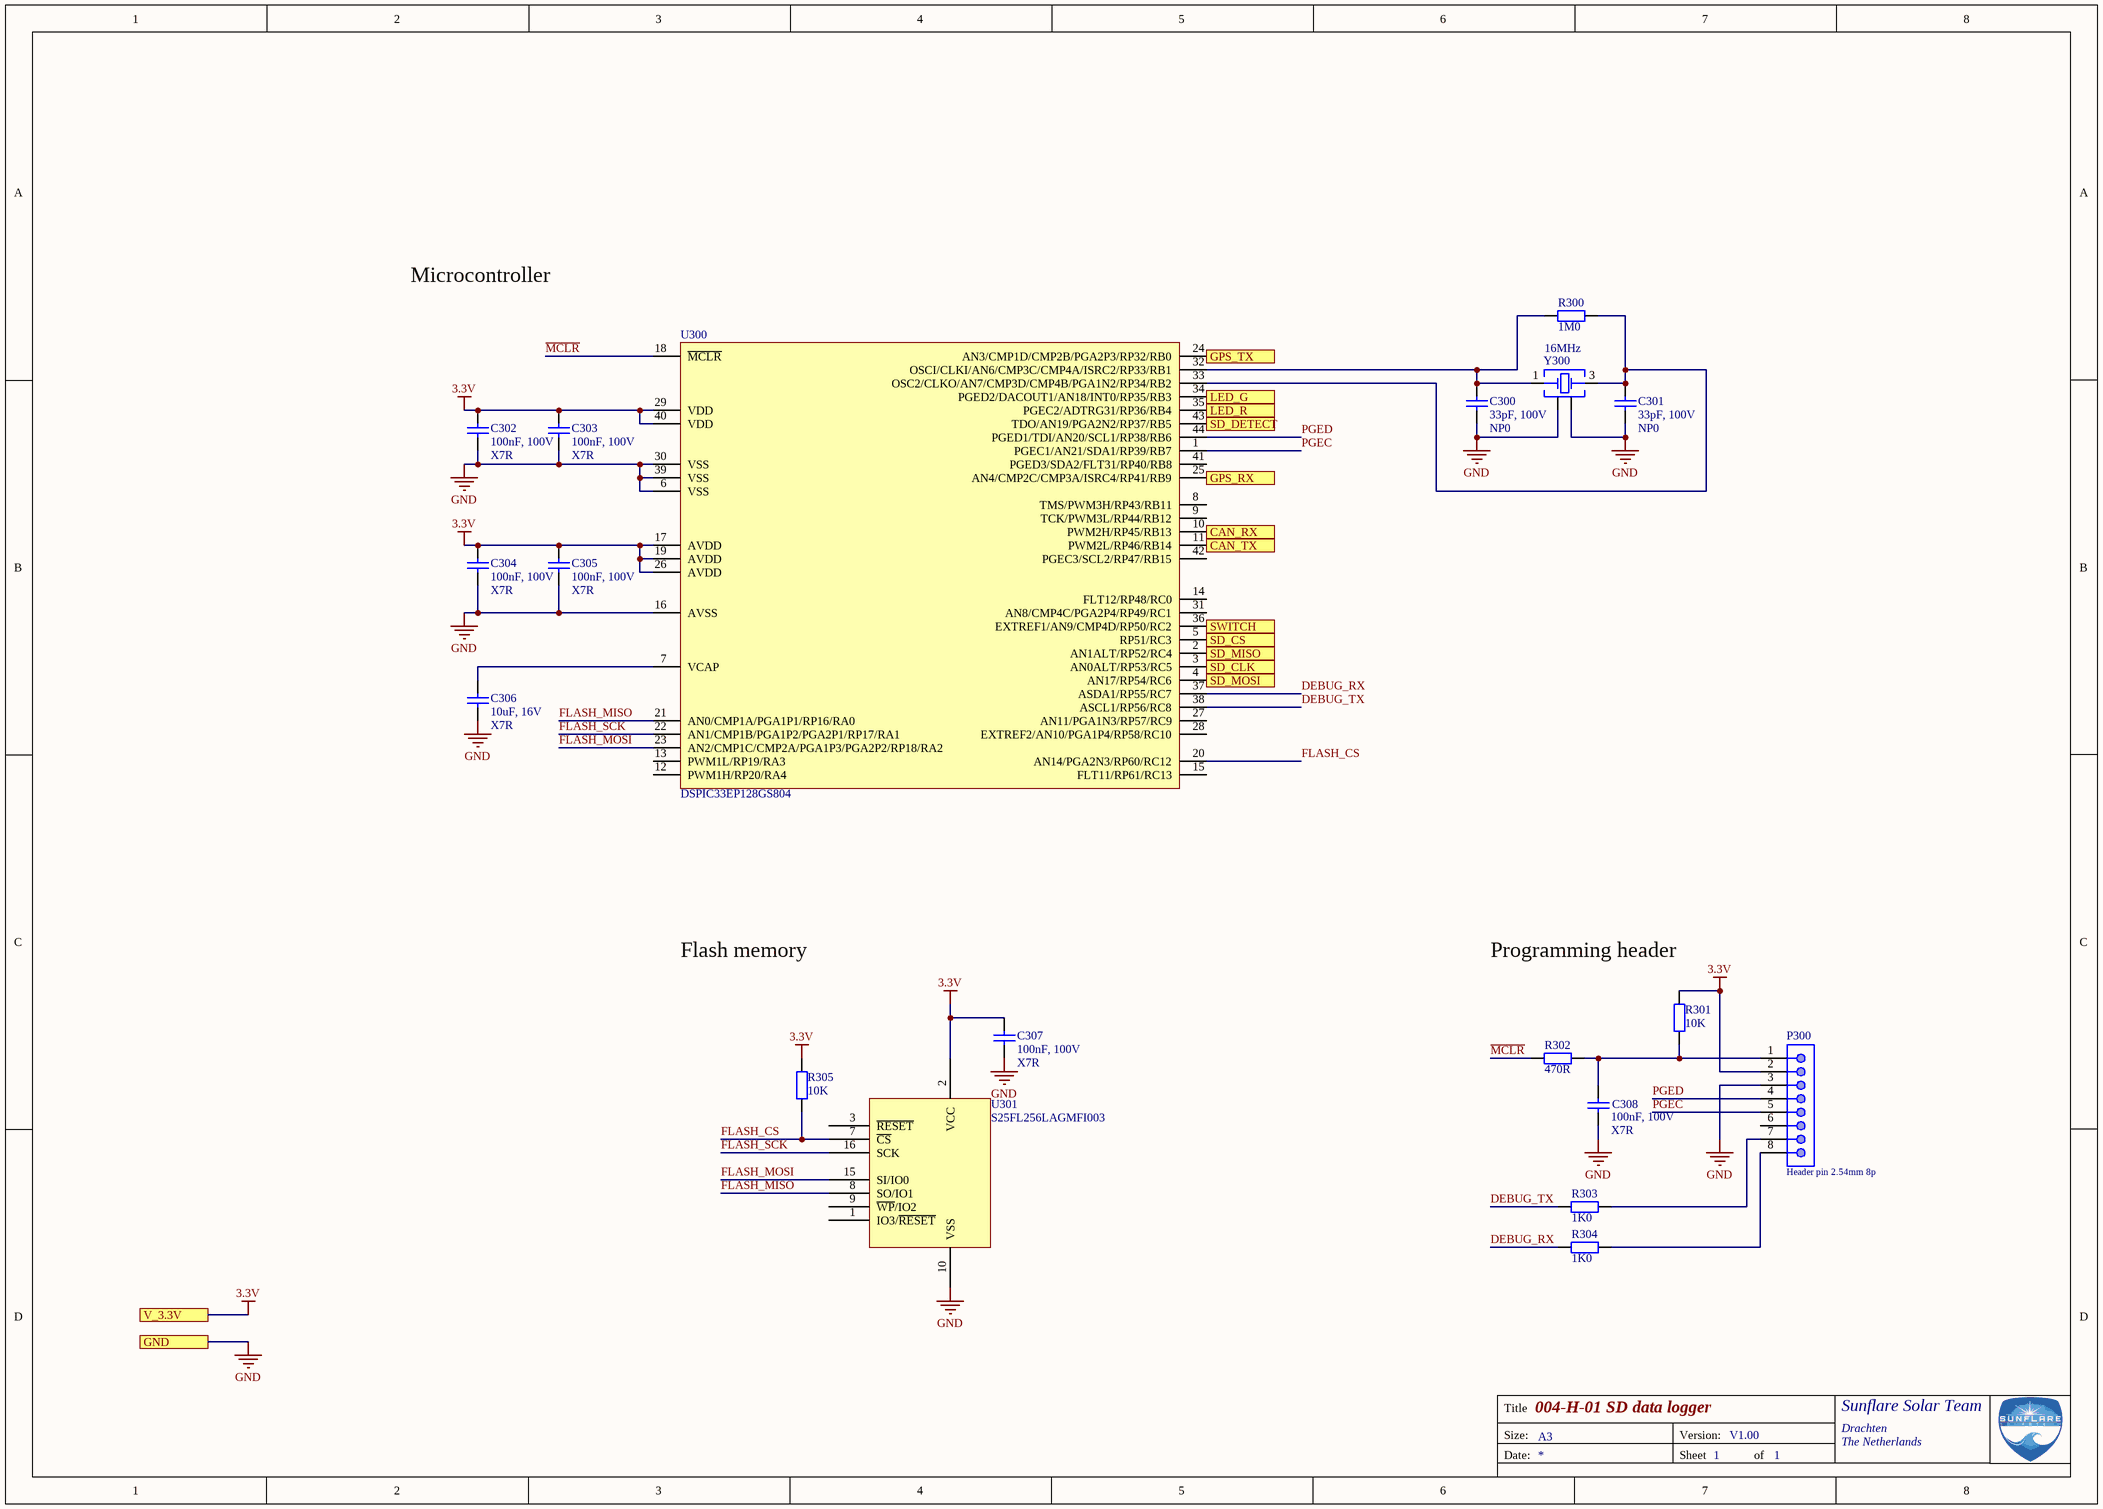
[diagram p3: system controller.SchDoc]

### Parts
C300  33pF, 100V  Ceramic Type: NP0  [CAP_0805]
C301  33pF, 100V  Ceramic Type: NP0  [CAP_0805]
C302  100nF, 100V  Ceramic Type: X7R  [CAP_0805]
C303  100nF, 100V  Ceramic Type: X7R  [CAP_0805]
C304  100nF, 100V  Ceramic Type: X7R  [CAP_0805]
C305  100nF, 100V  Ceramic Type: X7R  [CAP_0805]
C306  10uF, 16V  Ceramic Type: X7R  [CAP_1210]
C307  100nF, 100V  Ceramic Type: X7R  [CAP_0805]
C308  100nF, 100V  Ceramic Type: X7R  [CAP_0805]
P300  Header pin 2.54mm 8p  [WE-61300811121]
R300  1M0  [RES_0805]
R301  10K  [RES_0805]
R302  470R  [RES_0805]
R303  1K0  [RES_0805]
R304  1K0  [RES_0805]
R305  10K  [RES_0805]
U300  DSPIC33EP128GS804  [TQFP80P1200X1200X120-44N]
U301  S25FL256LAGMFI003  [SOIC127P1030X265-16N]
Y300  16MHz  [WE-XTAL_12SMX]

### Ports
CAN_RX, CAN_TX, GND, GPS_RX, GPS_TX, LED_G, LED_R, SD_CLK, SD_CS, SD_DETECT, SD_MISO, SD_MOSI, SWITCH, V_3.3V

### Nets
3.3V: C302.2 C303.2 C304.2 C305.2 C307.2 P300.2 R301.2 R305.2 U300.17(AVDD) U300.19(AVDD) U300.26(AVDD) U300.29(VDD) U300.40(VDD) U301.2(VCC) ; port V_3.3V
GND: C300.1 C301.1 C302.1 C303.1 C304.1 C305.1 C306.1 C307.1 C308.1 P300.3 U300.6(VSS) U300.16(AVSS) U300.30(VSS) U300.39(VSS) U301.10(VSS) Y300.2(GND_&_Lid) Y300.4(GND_&_Lid) ; port GND
CAN_RX: U300.10(PWM2H/RP45/RB13) ; port CAN_RX
CAN_TX: U300.11(PWM2L/RP46/RB14) ; port CAN_TX
DEBUG_RX: R304.1 U300.37(ASDA1/RP55/RC7)
DEBUG_TX: R303.1 U300.38(ASCL1/RP56/RC8)
FLASH_CS: R305.1 U300.20(AN14/PGA2N3/RP60/RC12) U301.7(~{CS})
FLASH_MISO: U300.21(AN0/CMP1A/PGA1P1/RP16/RA0) U301.8(SO/IO1)
FLASH_MOSI: U300.23(AN2/CMP1C/CMP2A/PGA1P3/PGA2P2/RP18/RA2) U301.15(SI/IO0)
FLASH_SCK: U300.22(AN1/CMP1B/PGA1P2/PGA2P1/RP17/RA1) U301.16(SCK)
LED_G: U300.35(PGEC2/ADTRG31/RP36/RB4) ; port LED_R
LED_R: U300.34(PGED2/DACOUT1/AN18/INT0/RP35/RB3) ; port LED_G
~{MCLR}: R302.1 U300.18(~{MCLR})
PGEC: P300.5 U300.1(PGEC1/AN21/SDA1/RP39/RB7)
PGED: P300.4 U300.44(PGED1/TDI/AN20/SCL1/RP38/RB6)
NetC300_2: C300.2 R300.1 U300.32(OSCI/CLKI/AN6/CMP3C/CMP4A/ISRC2/RP33/RB1) Y300.1(Crystal)
NetC301_2: C301.2 R300.2 U300.33(OSC2/CLKO/AN7/CMP3D/CMP4B/PGA1N2/RP34/RB2) Y300.3(Crystal)
NetC306_2: C306.2 U300.7(VCAP)
NetC308_2: C308.2 P300.1 R301.1 R302.2
NetP300_7: P300.7 R303.2
NetP300_8: P300.8 R304.2
NetR204_1: U300.5(RP51/RC3) ; port SD_CS
NetR208_1: U300.36(EXTREF1/AN9/CMP4D/RP50/RC2) ; port SWITCH
NetR209_1: U300.4(AN17/RP54/RC6) ; port SD_MOSI
NetR210_1: U300.3(AN0ALT/RP53/RC5) ; port SD_CLK
NetR211_1: U300.2(AN1ALT/RP52/RC4) ; port SD_MISO
NetR212_1: U300.25(AN4/CMP2C/CMP3A/ISRC4/RP41/RB9) ; port GPS_RX
NetR214_1: U300.24(AN3/CMP1D/CMP2B/PGA2P3/RP32/RB0) ; port GPS_TX
NetR215_1: U300.43(TDO/AN19/PGA2N2/RP37/RB5) ; port SD_DETECT

Not connected (* = marked no-connect by the designer): P300 6; U300 8(TMS/PWM3H/RP43/RB11) 9(TCK/PWM3L/RP44/RB12) 12(PWM1H/RP20/RA4) 13(PWM1L/RP19/RA3) 14(FLT12/RP48/RC0) 15(FLT11/RP61/RC13) 27(AN11/PGA1N3/RP57/RC9) 28(EXTREF2/AN10/PGA1P4/RP58/RC10) 31(AN8/CMP4C/PGA2P4/RP49/RC1) 41(PGED3/SDA2/FLT31/RP40/RB8) 42(PGEC3/SCL2/RP47/RB15); U301 1(IO3/~{RESET}) 3(~{RESET}) 9(~{WP}/IO2)

### Notes on the sheet
- Microcontroller
- Flash memory
- (near R301) Programming header
- Title
- Size:
- Date:
- A3
- Version:
- Sheet
- of

### Library data of the parts
C300 C301 = CAP_0805_33pF_100V: WCAP-CSGP Multilayer Ceramic Chip Capacitor, General Purpose, size 0805, NP0, 33pF, 100V; Manufacturer Part Number: 885012007079; Manufacturer: Wurth Elektronik; Rated Voltage: 100VDC; Isolation Resistance: >=10GOhm; Capacitance Tolerance: +/-5%; Dissipation Factor: Q>=1000; Technical Reference: NP00805330J100DFCT10000; ComponentLink1Description: Manufacturer; ComponentLink1URL: http://www.we-online.de; ComponentLink2Description: Datasheet; ComponentLink2URL: https://www.we-online.com/catalog/datasheet/885012007079.pdf; Operating Temperature: -55 to +125degC; Packaging: Tape and Reel; Published Date: May 2020; Height: 0.6mm; Mounting Technology: SMT; Size: 0805; Capacitance: 33pF
C302-C305 C307 C308 = CAP_0805_100nF_100V: as C100 on sheet bias supply; ComponentLink1Description: Manufacturer; ComponentLink1URL: http://www.we-online.de; ComponentLink2Description: Datasheet; ComponentLink2URL: https://www.we-online.com/catalog/datasheet/885012207128.pdf; Operating Temperature: -55 to +125degC; Packaging: Tape and Reel; Published Date: May 2020; Dissipation Factor: =<2.5%; Height: 1.25mm; Mounting Technology: SMT; Size: 0805; Capacitance: 100nF; Supplier 1: Farnell; Supplier Part Number 1: 2812440
C306 = CAP_1210_10uF_16V: as C206 on sheet interfaces; ComponentLink1Description: Manufacturer; ComponentLink1URL: http://www.we-online.de; ComponentLink2Description: Datasheet; ComponentLink2URL: https://www.we-online.com/catalog/datasheet/885012209014.pdf; Operating Temperature: -55 to +125degC; Packaging: Tape and Reel; Published Date: May 2020; Dissipation Factor: =<5%; Height: 2mm; Mounting Technology: SMT; Size: 1210; Capacitance: 10uF
P300 = Header pin 2.54mm 8p: WR-PHD Pin Header, THT, pitch 2.54mm, Single Row, Vertical, 8p; Manufacturer Part Number: 61300811121; Manufacturer: Wurth Elektronik; Pin Number: 8; Rated Current: 3A; Working Voltage: 250VAC; Withstanding Voltage: 500VAC; Contact Resistance: 20mOhm; ComponentLink1Description: Manufacturer; ComponentLink1URL: http://www.we-online.de; ComponentLink2Description: Datasheet; ComponentLink2URL: https://www.we-online.com/catalog/datasheet/61300811121.pdf; Published Date: May 2020; Pitch: 2.54mm; Operating Temperature: -40 to +105degC; Mounting Technology: THT; Packaging: Bag; Gender: Pin Header; Row Number: Single; Orientation: Vertical; Supplier 1: Farnell; Supplier Part Number 1: 2356160
R300 = RES_0805_1M0: Thick Film Resistor, size 0805, 1%; Rated Power: 0.125W; Resistance Tolerance: +/-1%; Resistance: 1M0; Height: 0.6mm; Operating Temperature: -55 to +155degC; Mounting Technology: SMT; Packaging: Tape and Reel; Size: 0805; Length: 2mm; Width: 1.25mm
R301 R305 = RES_0805_10K: as R204 on sheet interfaces; Resistance: 10K; Height: 0.6mm; Operating Temperature: -55 to +155degC; Mounting Technology: SMT; Packaging: Tape and Reel; Size: 0805; Length: 2mm; Width: 1.25mm
R302 = RES_0805_470R: as R201 on sheet interfaces; Resistance: 470R; Height: 0.6mm; Operating Temperature: -55 to +155degC; Mounting Technology: SMT; Packaging: Tape and Reel; Size: 0805; Length: 2mm; Width: 1.25mm
R303 R304 = RES_0805_1K0: as R208 on sheet interfaces; Resistance: 1K0; Height: 0.6mm; Operating Temperature: -55 to +155degC; Mounting Technology: SMT; Packaging: Tape and Reel; Size: 0805; Length: 2mm; Width: 1.25mm
U300 = DSPIC33EP128GS804: 16-Bit Digital Signal Controllers fo  r Digital Power Applications with   Interconnected High-Speed PWM, ADC, PGA and Comparators; Manufacturer: Microchip; Manufacturer Part No: DSPIC33EP128GS804-I/PT; Supplier 1: Farnell; Supplier Part Number 1: 2706170
U301 = S25FL256LAGMFI003: Flash Memory, Floating Gate Architecture, Serial NOR, 256 Mbit, 32M x 8bit, SPI, WSOIC, 16 Pins; Manufacturer: Cypress - Infineon Technologies; Manufacturer Part No: S25FL256LAGMFI003; Supplier 1: Farnell; Supplier Part Number 1: 2768046
Y300 = Crystal_16MHz: WE-XTAL Quartz Crystal, SMT, 12SMX, 16MHz, +/-30ppm; Manufacturer Part Number: 830026392; Manufacturer: Wurth Elektronik; Frequency Stability: +/-50ppm; Load Capacitance: 16pF; ComponentLink1Description: Manufacturer; ComponentLink1URL: http://www.we-online.de; ComponentLink2Description: Datasheet; ComponentLink2URL: https://katalog.we-online.com/pbs/datasheet/830026392.pdf; Operating Temperature: -20 to +70degC; Packaging: Tape and Reel; Published Date: July 2020; Size: 12SMX; Frequency: 16MHz; Frequency Tolerance: +/-30ppm; Mounting Technology: SMT

## Nets that join several sheets
3.3V: bias supply (C102.1 TP102.1 U101.2 U101.4), interfaces (11 pins), system controller (14 pins)
5V: bias supply (7 pins), interfaces (C200.2 U200.3)
5Vsec: bias supply (5 pins), interfaces (C208.2 C209.2 U203.1)
GND: bias supply (23 pins), interfaces (23 pins), system controller (17 pins)
CAN_+: bias supply (J100.1), interfaces (J200.6 J201.6)
CAN_-: bias supply (J101.1), interfaces (J200.3 J201.3)
CAN_RX: interfaces (R202.2), system controller (U300.10)
CAN_TX: interfaces (R201.2), system controller (U300.11)
LED_G: interfaces (R207.2), system controller (U300.35)
LED_R: interfaces (R206.1), system controller (U300.34)
NetR204_1: interfaces (R204.1 U201.1), system controller (U300.5)
NetR208_1: interfaces (R208.1), system controller (U300.36)
NetR209_1: interfaces (R209.1 U201.3), system controller (U300.4)
NetR210_1: interfaces (R210.1 U202.1), system controller (U300.3)
NetR211_1: interfaces (R211.1 U202.3), system controller (U300.2)
NetR212_1: interfaces (R212.1), system controller (U300.25)
NetR214_1: interfaces (R214.1), system controller (U300.24)
NetR215_1: interfaces (R215.1), system controller (U300.43)